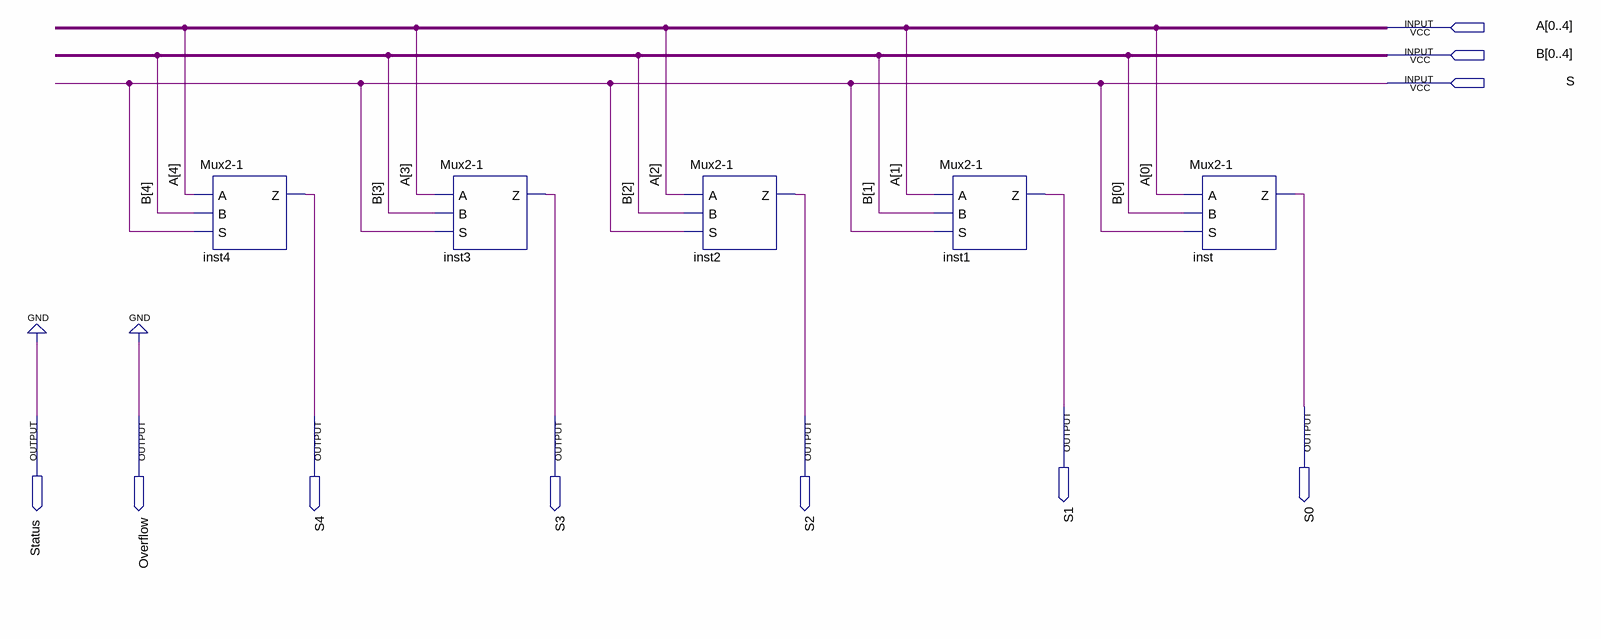
[diagram p0: schematic sheet]
// Quartus schematic mux-2-1_5bit.bdf as structural Verilog: 5 symbols, 10 pins
module \mux-2-1_5bit  (
  input  [0:4] A,
  input  [0:4] B,
  input  S,
  output S1,
  output S0,
  output Status,
  output Overflow,
  output S4,
  output S3,
  output S2
);

  \Mux2-1  inst4 (.A(A[4]), .B(B[4]), .S(S), .Z(S4));
  \Mux2-1  inst3 (.A(A[3]), .B(B[3]), .S(S), .Z(S3));
  \Mux2-1  inst2 (.A(A[2]), .B(B[2]), .S(S), .Z(S2));
  \Mux2-1  inst1 (.A(A[1]), .B(B[1]), .S(S), .Z(S1));
  \Mux2-1  inst (.A(A[0]), .B(B[0]), .S(S), .Z(S0));

  assign Overflow = 1'b0;
  assign Status = 1'b0;
endmodule
